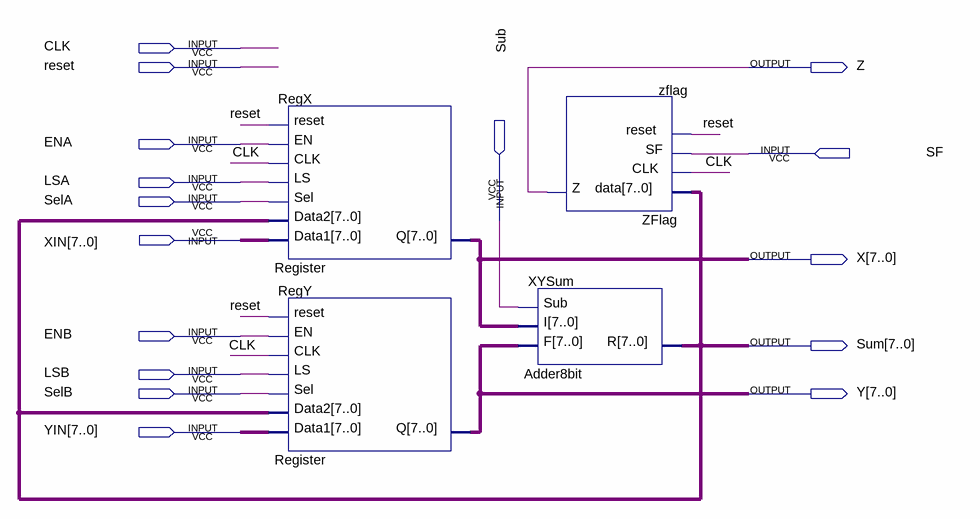
[diagram p0: schematic sheet]
// Quartus schematic Datapath.bdf as structural Verilog: 4 symbols, 16 pins
module Datapath (
  input  CLK,
  input  reset,
  input  ENA,
  input  SF,
  input  LSA,
  input  SelA,
  input  Sub,
  input  [7:0] XIN,
  input  ENB,
  input  LSB,
  input  SelB,
  input  [7:0] YIN,
  output Z,
  output [7:0] X,
  output [7:0] Sum,
  output [7:0] Y
);

  Register RegX (.Data1(XIN), .Data2(Sum), .Sel(SelA), .LS(LSA), .CLK(CLK), .EN(ENA), .reset(reset), .Q(X));
  Register RegY (.Data1(YIN), .Data2(Sum), .Sel(SelB), .LS(LSB), .CLK(CLK), .EN(ENB), .reset(reset), .Q(Y));
  ZFlag zflag (.data(Sum), .CLK(CLK), .SF(SF), .reset(reset), .Z(Z));
  Adder8bit XYSum (.F(Y), .I(X), .Sub(Sub), .R(Sum));
endmodule
